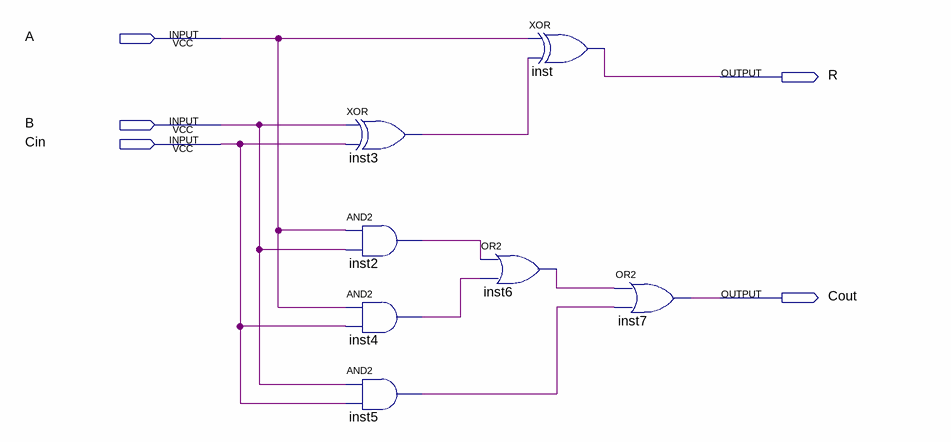
[diagram p0: schematic sheet]
// Quartus schematic somador1Bit.bdf as structural Verilog: 7 symbols, 5 pins
module somador1Bit (
  input  A,
  input  B,
  input  Cin,
  output R,
  output Cout
);

  wire inst2_out, inst3_out, inst4_out, inst5_out, inst6_out;

  xor inst3 (inst3_out, B, Cin);
  and inst2 (inst2_out, A, B);
  and inst4 (inst4_out, A, Cin);
  and inst5 (inst5_out, B, Cin);
  or inst6 (inst6_out, inst2_out, inst4_out);
  xor inst (R, A, inst3_out);
  or inst7 (Cout, inst6_out, inst5_out);
endmodule
